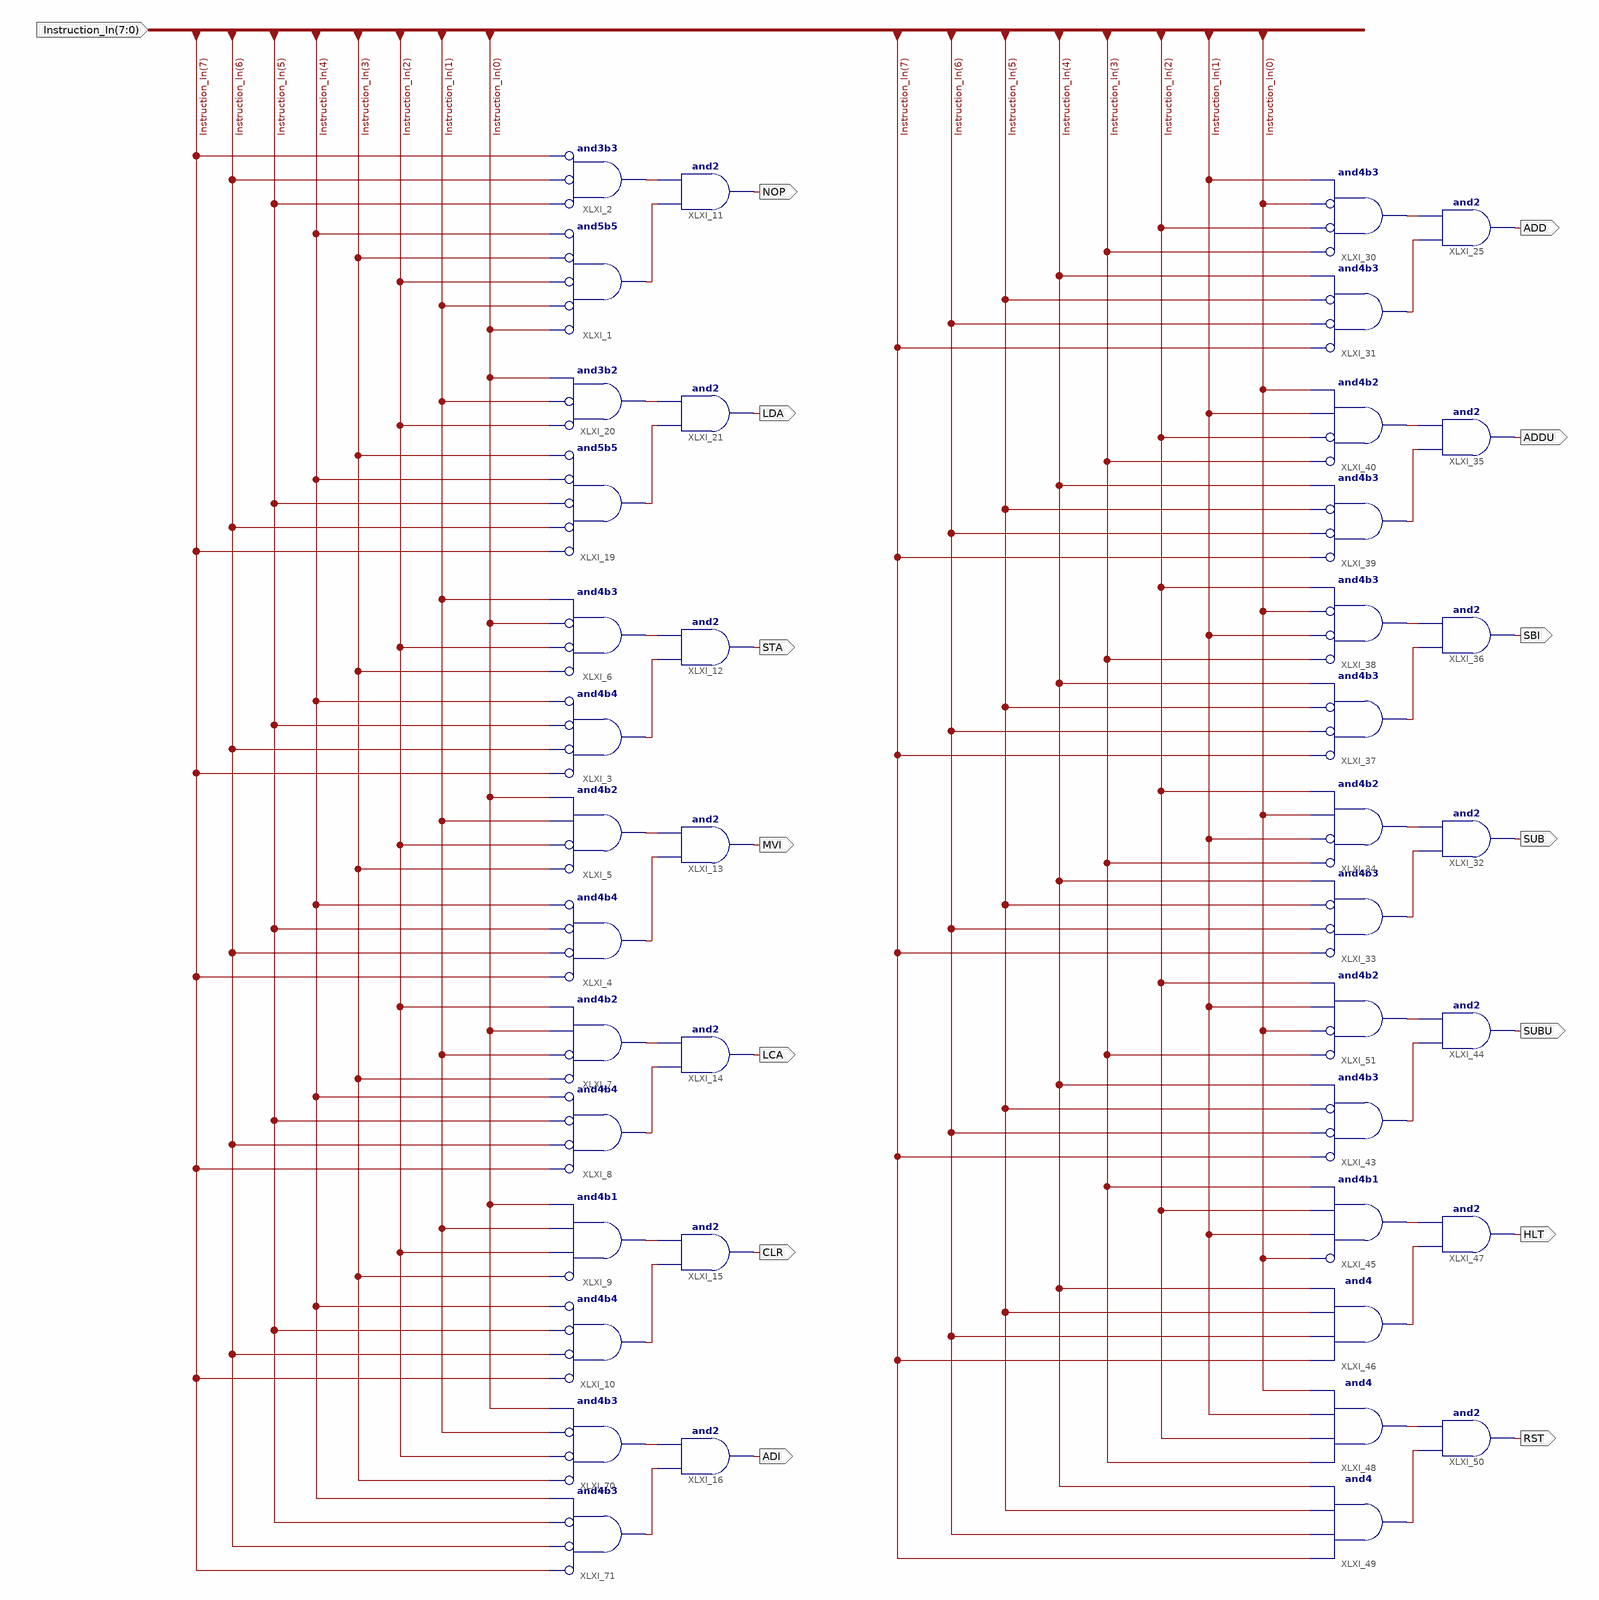
[diagram p0: schematic sheet 1]
// Xilinx ISE schematic Instruction_Decoder.sch (spartan3e) as structural Verilog: 42 symbols, 15 ports
module Instruction_Decoder (
  input  [7:0] Instruction_In,
  output NOP,
  output STA,
  output MVI,
  output LCA,
  output CLR,
  output ADI,
  output LDA,
  output HLT,
  output SUBU,
  output SUB,
  output SBI,
  output ADDU,
  output ADD,
  output RST
);

  wire XLXN_9, XLXN_12, XLXN_15, XLXN_18, XLXN_21, XLXN_29, XLXN_32, XLXN_83, XLXN_87, XLXN_92, XLXN_96,
       XLXN_99, XLXN_106, XLXN_110, XLXN_166, XLXN_168, XLXN_170, XLXN_172, XLXN_174, XLXN_176, XLXN_190,
       XLXN_199, XLXN_201, XLXN_203, XLXN_205, XLXN_207, XLXN_209, XLXN_211;

  and XLXI_1 (XLXN_9, ~Instruction_In[0], ~Instruction_In[1], ~Instruction_In[2], ~Instruction_In[3], ~Instruction_In[4]);  // and5b5
  and XLXI_2 (XLXN_166, ~Instruction_In[5], ~Instruction_In[6], ~Instruction_In[7]);  // and3b3
  and XLXI_3 (XLXN_12, ~Instruction_In[7], ~Instruction_In[6], ~Instruction_In[5], ~Instruction_In[4]);  // and4b4
  and XLXI_4 (XLXN_15, ~Instruction_In[7], ~Instruction_In[6], ~Instruction_In[5], ~Instruction_In[4]);  // and4b4
  and XLXI_5 (XLXN_172, ~Instruction_In[3], ~Instruction_In[2], Instruction_In[1], Instruction_In[0]);  // and4b2
  and XLXI_6 (XLXN_170, ~Instruction_In[3], ~Instruction_In[2], ~Instruction_In[0], Instruction_In[1]);  // and4b3
  and XLXI_7 (XLXN_174, ~Instruction_In[3], ~Instruction_In[1], Instruction_In[0], Instruction_In[2]);  // and4b2
  and XLXI_8 (XLXN_18, ~Instruction_In[7], ~Instruction_In[6], ~Instruction_In[5], ~Instruction_In[4]);  // and4b4
  and XLXI_9 (XLXN_176, ~Instruction_In[3], Instruction_In[2], Instruction_In[1], Instruction_In[0]);  // and4b1
  and XLXI_10 (XLXN_21, ~Instruction_In[7], ~Instruction_In[6], ~Instruction_In[5], ~Instruction_In[4]);  // and4b4
  and XLXI_11 (NOP, XLXN_9, XLXN_166);
  and XLXI_12 (STA, XLXN_12, XLXN_170);
  and XLXI_13 (MVI, XLXN_15, XLXN_172);
  and XLXI_14 (LCA, XLXN_18, XLXN_174);
  and XLXI_15 (CLR, XLXN_21, XLXN_176);
  and XLXI_16 (ADI, XLXN_29, XLXN_190);
  and XLXI_70 (XLXN_190, ~Instruction_In[3], ~Instruction_In[2], ~Instruction_In[1], Instruction_In[0]);  // and4b3
  and XLXI_71 (XLXN_29, ~Instruction_In[7], ~Instruction_In[6], ~Instruction_In[5], Instruction_In[4]);  // and4b3
  and XLXI_19 (XLXN_32, ~Instruction_In[7], ~Instruction_In[6], ~Instruction_In[5], ~Instruction_In[4], ~Instruction_In[3]);  // and5b5
  and XLXI_20 (XLXN_168, ~Instruction_In[2], ~Instruction_In[1], Instruction_In[0]);  // and3b2
  and XLXI_21 (LDA, XLXN_32, XLXN_168);
  and XLXI_50 (RST, XLXN_110, XLXN_211);
  and XLXI_49 (XLXN_110, Instruction_In[7], Instruction_In[6], Instruction_In[5], Instruction_In[4]);
  and XLXI_48 (XLXN_211, Instruction_In[3], Instruction_In[2], Instruction_In[1], Instruction_In[0]);
  and XLXI_25 (ADD, XLXN_83, XLXN_199);
  and XLXI_47 (HLT, XLXN_106, XLXN_209);
  and XLXI_46 (XLXN_106, Instruction_In[7], Instruction_In[6], Instruction_In[5], Instruction_In[4]);
  and XLXI_44 (SUBU, XLXN_99, XLXN_207);
  and XLXI_45 (XLXN_209, ~Instruction_In[0], Instruction_In[1], Instruction_In[2], Instruction_In[3]);  // and4b1
  and XLXI_43 (XLXN_99, ~Instruction_In[7], ~Instruction_In[6], ~Instruction_In[5], Instruction_In[4]);  // and4b3
  and XLXI_51 (XLXN_207, ~Instruction_In[3], ~Instruction_In[0], Instruction_In[1], Instruction_In[2]);  // and4b2
  and XLXI_32 (SUB, XLXN_96, XLXN_205);
  and XLXI_33 (XLXN_96, ~Instruction_In[7], ~Instruction_In[6], ~Instruction_In[5], Instruction_In[4]);  // and4b3
  and XLXI_34 (XLXN_205, ~Instruction_In[3], ~Instruction_In[1], Instruction_In[0], Instruction_In[2]);  // and4b2
  and XLXI_35 (ADDU, XLXN_87, XLXN_201);
  and XLXI_36 (SBI, XLXN_92, XLXN_203);
  and XLXI_37 (XLXN_92, ~Instruction_In[7], ~Instruction_In[6], ~Instruction_In[5], Instruction_In[4]);  // and4b3
  and XLXI_38 (XLXN_203, ~Instruction_In[3], ~Instruction_In[1], ~Instruction_In[0], Instruction_In[2]);  // and4b3
  and XLXI_39 (XLXN_87, ~Instruction_In[7], ~Instruction_In[6], ~Instruction_In[5], Instruction_In[4]);  // and4b3
  and XLXI_40 (XLXN_201, ~Instruction_In[3], ~Instruction_In[2], Instruction_In[1], Instruction_In[0]);  // and4b2
  and XLXI_31 (XLXN_83, ~Instruction_In[7], ~Instruction_In[6], ~Instruction_In[5], Instruction_In[4]);  // and4b3
  and XLXI_30 (XLXN_199, ~Instruction_In[3], ~Instruction_In[2], ~Instruction_In[0], Instruction_In[1]);  // and4b3
endmodule
